# Altium schematic sheet HDMI_Bridge.SchDoc
size A4; SheetNumber: 1; SheetTotal: 3
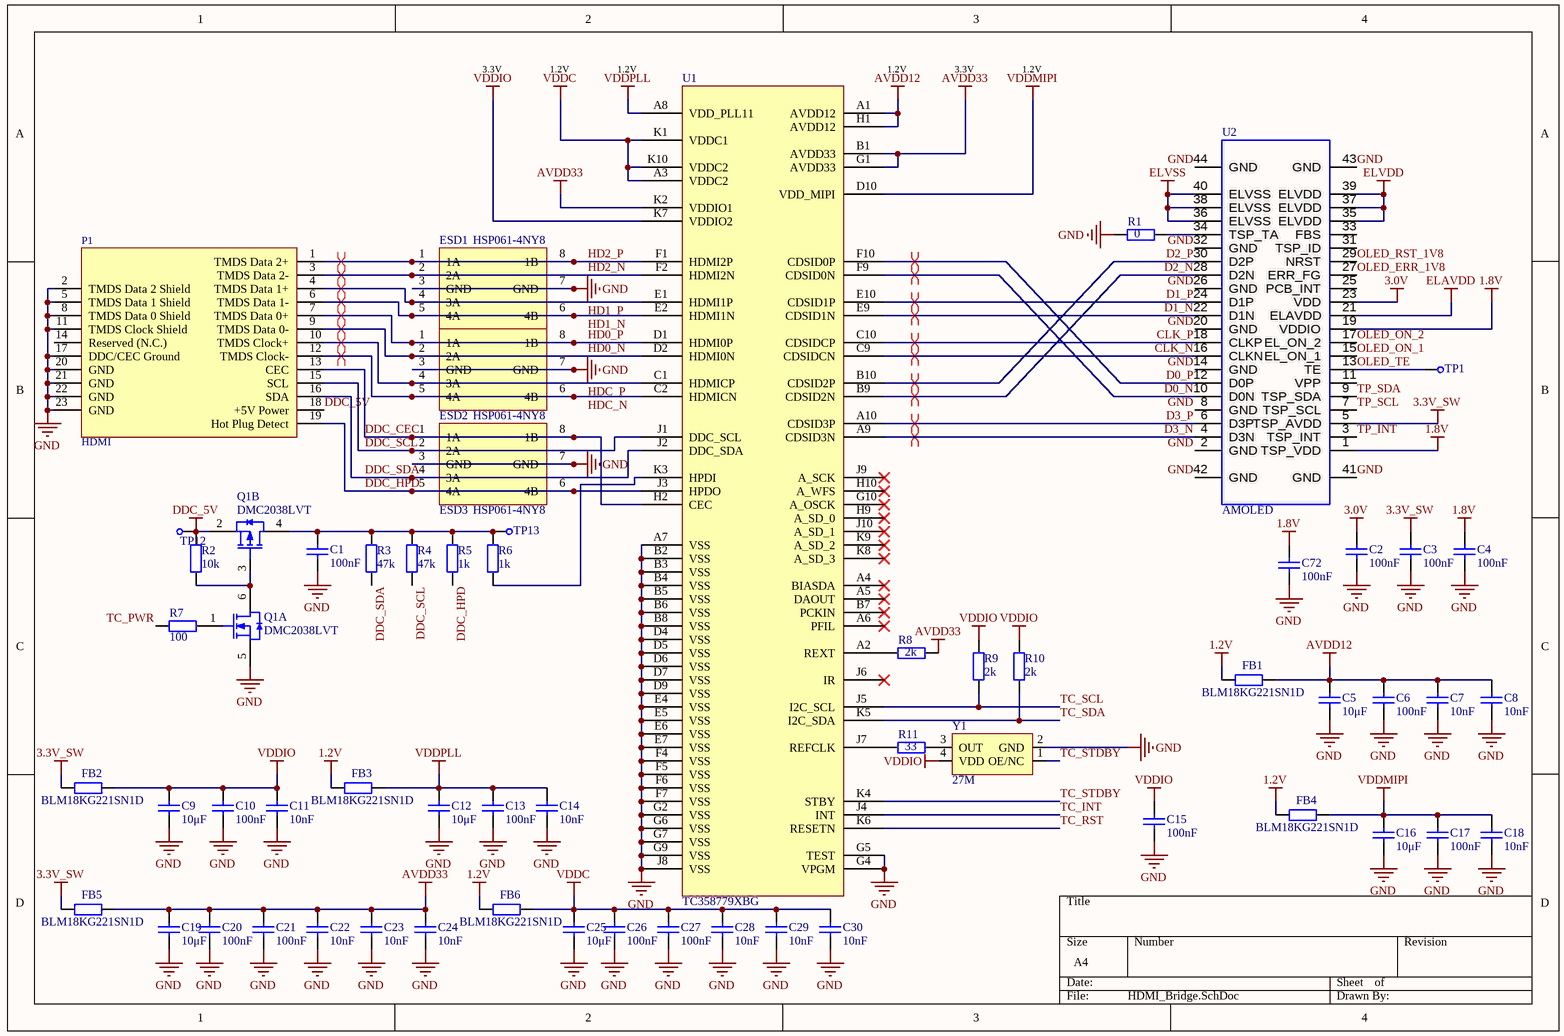
[diagram p0: HDMI_Bridge.SchDoc]

## Parts
C1  value 100nF  [0402C]  (hidden comment: Cap)
C2  value 100nF  [0402C]  (hidden comment: Cap)
C3  value 100nF  [0402C]  (hidden comment: Cap)
C4  value 100nF  [0402C]  (hidden comment: Cap)
C5  value 10μF  [0603C]  (hidden comment: Cap)
C6  value 100nF  [0402C]  (hidden comment: Cap)
C7  value 10nF  [0402C]  (hidden comment: Cap)
C8  value 10nF  [0402C]  (hidden comment: Cap)
C9  value 10μF  [0603C]  (hidden comment: Cap)
C10  value 100nF  [0402C]  (hidden comment: Cap)
C11  value 10nF  [0402C]  (hidden comment: Cap)
C12  value 10μF  [0603C]  (hidden comment: Cap)
C13  value 100nF  [0402C]  (hidden comment: Cap)
C14  value 10nF  [0402C]  (hidden comment: Cap)
C15  value 100nF  [0402C]  (hidden comment: Cap)
C16  value 10μF  [0603C]  (hidden comment: Cap)
C17  value 100nF  [0402C]  (hidden comment: Cap)
C18  value 10nF  [0402C]  (hidden comment: Cap)
C19  value 10μF  [0603C]  (hidden comment: Cap)
C20  value 100nF  [0402C]  (hidden comment: Cap)
C21  value 100nF  [0402C]  (hidden comment: Cap)
C22  value 10nF  [0402C]  (hidden comment: Cap)
C23  value 10nF  [0402C]  (hidden comment: Cap)
C24  value 10nF  [0402C]  (hidden comment: Cap)
C25  value 10μF  [0603C]  (hidden comment: Cap)
C26  value 100nF  [0402C]  (hidden comment: Cap)
C27  value 100nF  [0402C]  (hidden comment: Cap)
C28  value 10nF  [0402C]  (hidden comment: Cap)
C29  value 10nF  [0402C]  (hidden comment: Cap)
C30  value 10nF  [0402C]  (hidden comment: Cap)
C72  value 100nF  [0402C]  (hidden comment: Cap)
ESD1  HSP061-4NY8  [HSP061-4NY8]
ESD2  HSP061-4NY8  [HSP061-4NY8]
ESD3  HSP061-4NY8  [HSP061-4NY8]
FB1  value BLM18KG221SN1D  [0603R]  (hidden comment: Resistor)
FB2  value BLM18KG221SN1D  [0603R]  (hidden comment: Resistor)
FB3  value BLM18KG221SN1D  [0603R]  (hidden comment: Resistor)
FB4  value BLM18KG221SN1D  [0603R]  (hidden comment: Resistor)
FB5  value BLM18KG221SN1D  [0603R]  (hidden comment: Resistor)
FB6  value BLM18KG221SN1D  [0603R]  (hidden comment: Resistor)
P1  HDMI  [HDMI-SMD_HDMI-001S]
Q1  DMC2038LVT  [SOT-23-6]  (parts A,B of 2)
R1  value 0  [0402R]  (hidden comment: Resistor)
R2  value 10k  [0402R]  (hidden comment: Resistor)
R3  value 47k  [0402R]  (hidden comment: Resistor)
R4  value 47k  [0402R]  (hidden comment: Resistor)
R5  value 1k  [0402R]  (hidden comment: Resistor)
R6  value 1k  [0402R]  (hidden comment: Resistor)
R7  value 100  [0402R]  (hidden comment: Resistor)
R8  value 2k  [0402R]  (hidden comment: Resistor)
R9  value 2k  [0402R]  (hidden comment: Resistor)
R10  value 2k  [0402R]  (hidden comment: Resistor)
R11  value 33  [0402R]  (hidden comment: Resistor)
TP1  CHECK  [CHECK-B]  (value not drawn)
TP12  CHECK  [CHECK-B]  (value not drawn)
TP13  CHECK  [CHECK-B]  (value not drawn)
U1  TC358779XBG  [BGA-80_L7.0-W7.0-R10-C10-P0.65-TL]
U2  AMOLED  [BTB_AXE440124]
Y1  value 27M  [XTAL-3225-4P]  (hidden comment: XATLS)

## Nets
1.2V: FB1.1 FB3.1 FB4.1 FB6.1
1.8V: C4.2 C72.2 U2.1(TSP_VDD) U2.19(VDDIO)
3.0V: C2.2 U2.23(VDD)
3.3V_SW: C3.2 FB2.1 FB5.1 U2.5(TSP_AVDD)
AVDD12: C5.2 C6.2 C7.2 C8.2 FB1.2 U1.A1(AVDD12) U1.H1(AVDD12)
AVDD33: C19.2 C20.2 C21.2 C22.2 C23.2 C24.2 FB5.2 R8.1 U1.B1(AVDD33) U1.G1(AVDD33) U1.K2(VDDIO1)
DDC_5V: P1.18(+5V_Power) Q1.2(S) R2.1 TP12.1
ELAVDD: U2.21(ELAVDD)
ELVDD: U2.35(ELVDD) U2.37(ELVDD) U2.39(ELVDD)
ELVSS: U2.36(ELVSS) U2.38(ELVSS) U2.40(ELVSS)
GND: C1.1 C2.1 C3.1 C4.1 C5.1 C6.1 C7.1 C8.1 C9.1 C10.1 C11.1 C12.1 C13.1 C14.1 C15.1 C16.1 C17.1 C18.1 C19.1 C20.1 C21.1 C22.1 C23.1 C24.1 C25.1 C26.1 C27.1 C28.1 C29.1 C30.1 C72.1 ESD1.3(GND) ESD1.7(GND) ESD2.3(GND) ESD2.7(GND) ESD3.3(GND) ESD3.7(GND) P1.2(TMDS_Data_2_Shield) P1.5(TMDS_Data_1_Shield) P1.8(TMDS_Data_0_Shield) P1.11(TMDS_Clock_Shield) P1.17(DDC/CEC_Ground) P1.20(GND) P1.21(GND) P1.22(GND) P1.23(GND) Q1.5(S) R1.2 U1.A7(VSS) U1.B2(VSS) U1.B3(VSS) U1.B4(VSS) U1.B5(VSS) U1.B6(VSS) U1.B8(VSS) U1.D4(VSS) U1.D5(VSS) U1.D6(VSS) U1.D7(VSS) U1.D9(VSS) U1.E4(VSS) U1.E5(VSS) U1.E6(VSS) U1.E7(VSS) U1.F4(VSS) U1.F5(VSS) U1.F6(VSS) U1.F7(VSS) U1.G2(VSS) U1.G4(VPGM) U1.G5(TEST) U1.G6(VSS) U1.G7(VSS) U1.G9(VSS) U1.J8(VSS) U2.2(GND) U2.8(GND) U2.14(GND) U2.20(GND) U2.26(GND) U2.32(GND) U2.41(GND) U2.42(GND) U2.43(GND) U2.44(GND) Y1.2(GND)
VDDC: C25.2 C26.2 C27.2 C28.2 C29.2 C30.2 FB6.2 U1.A3(VDDC2) U1.K1(VDDC1) U1.K10(VDDC2)
VDDIO: C9.2 C10.2 C11.2 C15.2 FB2.2 R9.1 R10.1 U1.K7(VDDIO2) Y1.4(VDD)
VDDMIPI: C16.2 C17.2 C18.2 FB4.2 U1.D10(VDD_MIPI)
VDDPLL: C12.2 C13.2 C14.2 FB3.2 U1.A8(VDD_PLL11)
CLK_N: U1.C9(CDSIDCN) U2.16(CLKN)
CLK_P: U1.C10(CDSIDCP) U2.18(CLKP)
D0_N: U1.F9(CDSID0N) U2.10(D0N)
D0_P: U1.F10(CDSID0P) U2.12(D0P)
D1_N: U1.E9(CDSID1N) U2.22(D1N)
D1_P: U1.E10(CDSID1P) U2.24(D1P)
D2_N: U1.B9(CDSID2N) U2.28(D2N)
D2_P: U1.B10(CDSID2P) U2.30(D2P)
D3_N: U1.A9(CDSID3N) U2.4(D3N)
D3_P: U1.A10(CDSID3P) U2.6(D3P)
DDC_CEC: ESD3.1(1A) ESD3.8(1B) P1.13(CEC) U1.H2(CEC)
DDC_HPD: ESD3.5(4A) ESD3.6(4B) P1.19(Hot_Plug_Detect) R5.2 U1.J3(HPDO)
DDC_SCL: ESD3.2(2A) P1.15(SCL) R4.2 U1.J1(DDC_SCL)
DDC_SDA: ESD3.4(3A) P1.16(SDA) R3.2 U1.J2(DDC_SDA)
HD0_N: ESD2.2(2A) P1.9(TMDS_Data_0-) U1.D2(HDMI0N)
HD0_P: ESD2.1(1A) ESD2.8(1B) P1.7(TMDS_Data_0+) U1.D1(HDMI0P)
HD1_N: ESD1.5(4A) ESD1.6(4B) P1.6(TMDS_Data_1-) U1.E2(HDMI1N)
HD1_P: ESD1.4(3A) P1.4(TMDS_Data_1+) U1.E1(HDMI1P)
HD2_N: ESD1.2(2A) P1.3(TMDS_Data_2-) U1.F2(HDMI2N)
HD2_P: ESD1.1(1A) ESD1.8(1B) P1.1(TMDS_Data_2+) U1.F1(HDMI2P)
HDC_N: ESD2.5(4A) ESD2.6(4B) P1.12(TMDS_Clock-) U1.C2(HDMICN)
HDC_P: ESD2.4(3A) P1.10(TMDS_Clock+) U1.C1(HDMICP)
OLED_ERR_1V8: U2.27(ERR_FG)
OLED_ON_1: U2.15(EL_ON_1)
OLED_ON_2: U2.17(EL_ON_2)
OLED_RST_1V8: U2.29(NRST)
OLED_TE: TP1.1 U2.13(TE)
TC_INT: U1.J4(INT)
TC_PWR: R7.1
TC_RST: U1.K6(RESETN)
TC_SCL: R9.2 U1.J5(I2C_SCL)
TC_SDA: R10.2 U1.K5(I2C_SDA)
TC_STDBY: U1.K4(STBY) Y1.1(OE/NC)
TP_INT: U2.3(TSP_INT)
TP_SCL: U2.7(TSP_SCL)
TP_SDA: U2.9(TSP_SDA)
NetC1_2: C1.2 Q1.4(D) R3.1 R4.1 R5.1 R6.1 TP13.1
NetQ1_1: Q1.1(G) R7.2
NetQ1_3: Q1.3(G) Q1.6(D) R2.2
NetR1_1: R1.1 U2.34(TSP_TA)
NetR6_2: R6.2 U1.K3(HPDI)
NetR8_2: R8.2 U1.A2(REXT)
NetR11_1: R11.1 Y1.3(OUT)
NetR11_2: R11.2 U1.J7(REFCLK)

Not connected (* = marked no-connect by the designer): P1 14(Reserved_(N.C.)); U1 A4(BIASDA)* A5(DAOUT)* A6(PFIL)* B7(PCKIN)* G10(A_OSCK)* H9(A_SD_0)* H10(A_WFS)* J6(IR)* J9(A_SCK)* J10(A_SD_1)* K8(A_SD_3)* K9(A_SD_2)*; U2 11(VPP) 25(PCB_INT) 31(TSP_ID) 33(FBS)

## Layout directives
differential pair: CLK_N, CLK_P, D0_N, D0_P, D1_N, D1_P, D2_N, D2_P, D3_N, D3_P, HD0_N, HD0_P, HD1_N, HD1_P, HD2_N, HD2_P, HDC_N, HDC_P

## Notes on the sheet
- 3.3V
- 1.2V

## Library data of the parts
C1-C30 C72 = Cap: 无极性电容; Published: 8-Jun-2000; LatestRevisionDate: 17-Jul-2002; LatestRevisionNote: Re-released for DXP Platform.; PackageReference: RAD-0.3; Publisher: Altium Limited
ESD1-ESD3 = HSP061-4NY8: IC, 4-LINE ESD PROTECTION ARRAY, HIGH SPEED; Manufacturer: STMICROELECTRONICS; Part Number: HSP061-4NY8; Verified Pinout: *
FB1-FB6 R1-R11 = Resistor: 电阻; Published: 8-Jun-2000; LatestRevisionDate: 17-Jul-2002; LatestRevisionNote: Re-released for DXP Platform.; PackageReference: AXIAL-0.4; Publisher: Altium Limited
P1 = HDMI-Slot: HDMI Slot; BOM_Manufacturer: XUNPU(讯普); BOM_Manufacturer Part: HDMI-001S; Contributor: LCSC; BOM_Supplier: LCSC; BOM_Supplier Part: C720616; BOM_JLCPCB Part Class: Extended Part; spicePre: U; spiceSymbolName: HDMI-001S
Q1 = DMC2038LVT: Dual P + N MOS
TP1 TP12 TP13 = CHECK: 测试点
U1 = TC358779XBG: IC, HDMI RX TO MIPI DSI TX BRIDGE; Manufacturer: TOSHIBA; Part Number: TC358779XBG; Verified Pinout: *
U2 = OLED_AMS568: SAMSUNG AMOLED, CONNECTOR AXE440124, 40-PIN HEADER, 0.4MM PITCH; Manufacturer: PANASONIC; Part Number: AXE440124; Verified Pinout: *
Y1 = XATL-OSC: 贴片有源晶振